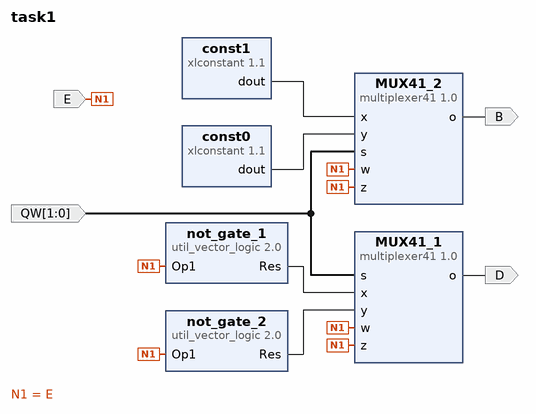
[diagram p0: block diagram of the top level]
# Vivado block design task1, xc7a100tfgg484-1, Vivado 2017.4
create_bd_design task1

create_bd_port -dir O D
create_bd_port -dir O B
create_bd_port -dir I -from 1 -to 0 QW
create_bd_port -dir I E

create_bd_cell -type ip -vlnv xilinx.com:user:multiplexer41:1.0 MUX41_2
create_bd_cell -type ip -vlnv xilinx.com:user:multiplexer41:1.0 MUX41_1
create_bd_cell -type ip -vlnv xilinx.com:ip:util_vector_logic:2.0 not_gate_1
set_property -dict {CONFIG.C_SIZE 1 CONFIG.C_OPERATION not} [get_bd_cells not_gate_1]
create_bd_cell -type ip -vlnv xilinx.com:ip:util_vector_logic:2.0 not_gate_2
set_property -dict {CONFIG.C_SIZE 1 CONFIG.C_OPERATION not} [get_bd_cells not_gate_2]
create_bd_cell -type ip -vlnv xilinx.com:ip:xlconstant:1.1 const1
create_bd_cell -type ip -vlnv xilinx.com:ip:xlconstant:1.1 const0
set_property -dict {CONFIG.CONST_VAL 0} [get_bd_cells const0]

# ---- connections ----

connect_bd_net [get_bd_pins MUX41_1/o] [get_bd_ports D]
connect_bd_net [get_bd_pins MUX41_2/o] [get_bd_ports B]
connect_bd_net -net xy_1 [get_bd_ports QW] [get_bd_pins MUX41_1/s] [get_bd_pins MUX41_2/s]
connect_bd_net [get_bd_ports E] \
  [get_bd_pins MUX41_1/w] [get_bd_pins not_gate_1/Op1] [get_bd_pins not_gate_2/Op1] [get_bd_pins MUX41_1/z] \
  [get_bd_pins MUX41_2/w] [get_bd_pins MUX41_2/z]
connect_bd_net -net util_vector_logic_0_Res [get_bd_pins not_gate_1/Res] [get_bd_pins MUX41_1/x]
connect_bd_net [get_bd_pins not_gate_2/Res] [get_bd_pins MUX41_1/y]
connect_bd_net -net xlconstant_0_dout [get_bd_pins const1/dout] [get_bd_pins MUX41_2/x]
connect_bd_net -net xlconstant_1_dout [get_bd_pins const0/dout] [get_bd_pins MUX41_2/y]

validate_bd_design
save_bd_design
